# EAGLE design Open Ephys Isolater (EAGLE 7.3.0)
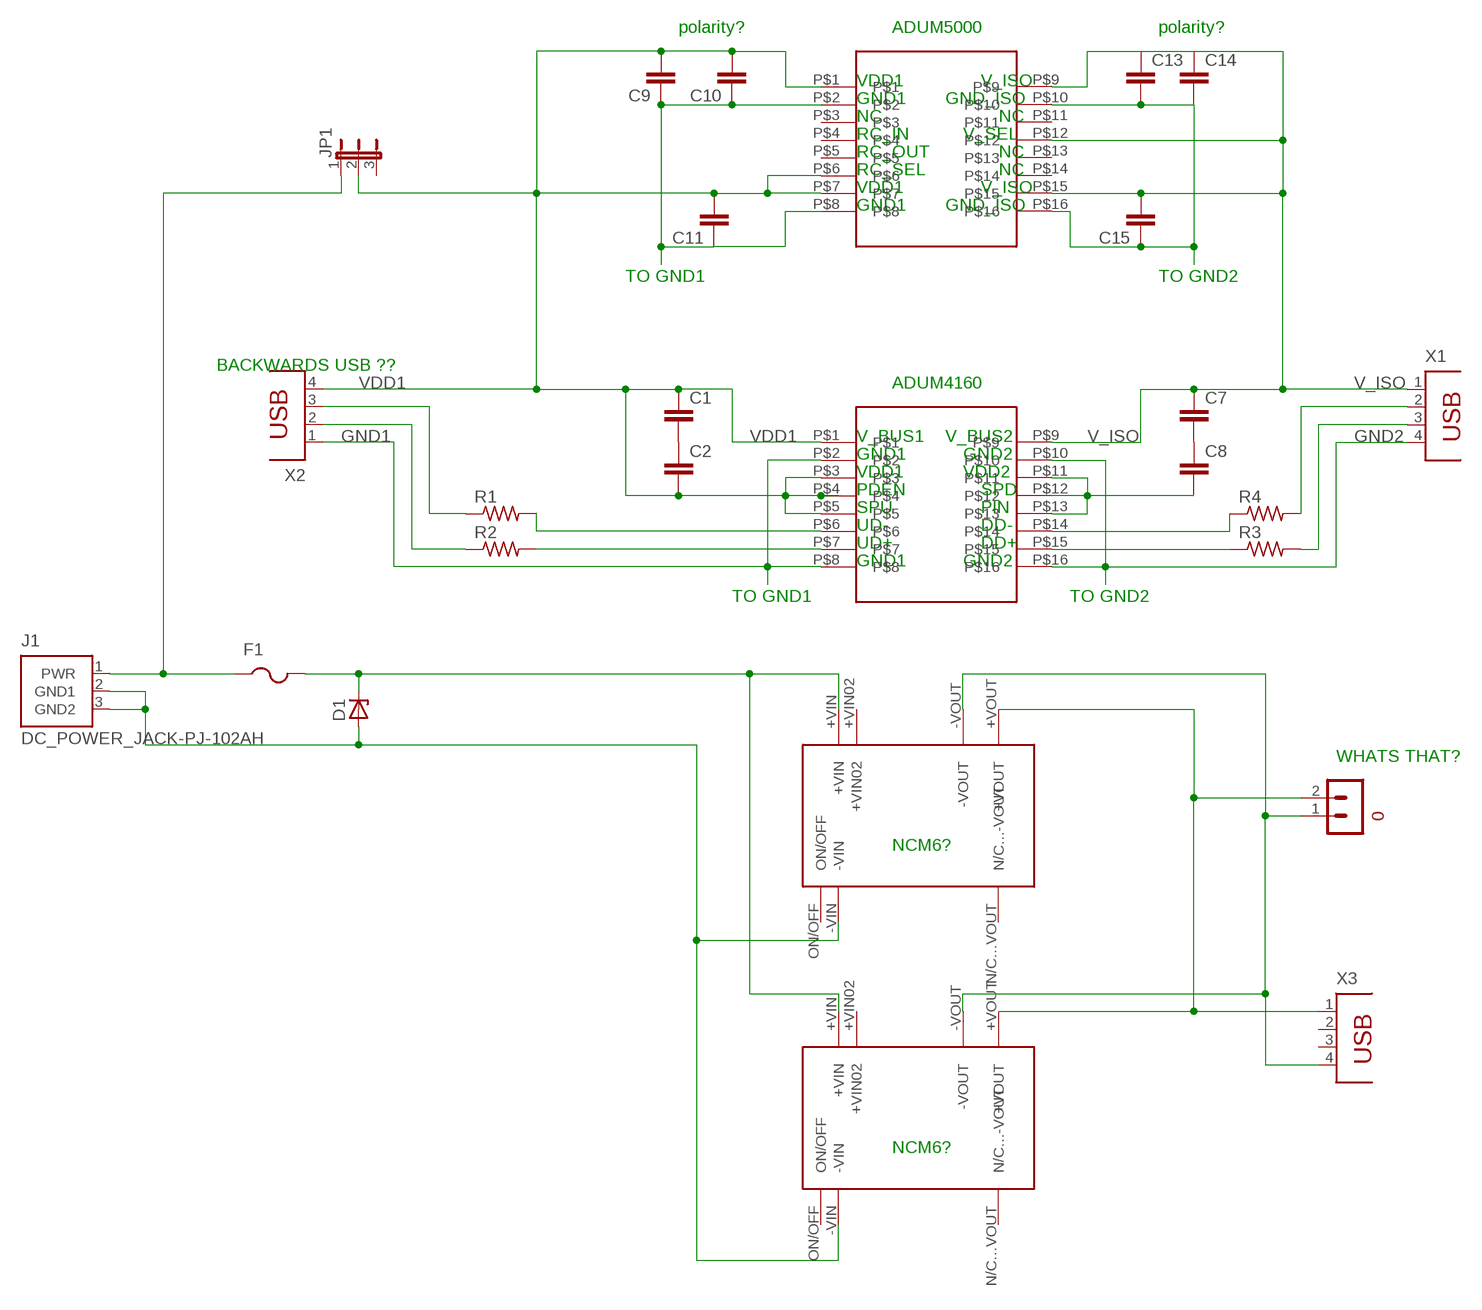
[diagram p0: schematic, sheet 1]

## Parts
C1  C_0201  [0201]
C2  C_0201  [0201]
C7  C_0201  [0201]
C8  C_0201  [0201]
C9  C_0201  [0201]
C10  C_0201  [0201]
C11  C_0201  [0201]
C13  C_0201  [0201]
C14  C_0201  [0201]
C15  C_0201  [0201]
D1  ZENER-DIODESMB  [SMB]
F1  PTCFUSE-1206  [R1206]
J1  DC_POWER_JACK-PJ-102AH  [PJ-102AH]
JP1  JP2E  [JP2]
R1  R-US_R2512  [R2512]
R2  R-US_R2512  [R2512]
R3  R-US_R2512  [R2512]
R4  R-US_R2512  [R2512]
S1  TERMINAL_BLOCK_2-3.5MM-5V  [TERMINAL_BLOCK_3.5MM_2_5V]
U$1  ADUM4160  [ADUM4160]
U$2  ADUM4160  [ADUM4160]
U$3  NCM6S0505EC  [NCM6S0505EC]
U$4  NCM6S0505EC  [NCM6S0505EC]
X1  PN87520  [PN87520]
X2  PN61729  [PN61729]
X3  PN87520  [PN87520]

## Nets
GND1: C9.1 C10.1 C11.1 D1.A J1.2(GND1) J1.3(GND2) U$1.P$2 U$1.P$8 U$2.P$2 U$2.P$8 U$3.-VIN U$4.-VIN X2.1
GND2: C13.2 C14.2 C15.1 S1.1 U$1.P$10 U$1.P$16 U$2.P$10 U$2.P$16 U$3.-VOUT U$4.-VOUT X1.4 X3.4
N$1: R1.1 X2.3
N$5: R1.2 U$2.P$6
N$6: R2.2 U$2.P$7
N$7: F1.1 J1.1(PWR) JP1.1
N$8: C7.2 C8.1
N$9: R2.1 X2.2
N$10: C8.2 U$2.P$11 U$2.P$12 U$2.P$13
N$11: C1.2 C2.1
N$12: S1.2 U$3.+VOUT U$4.+VOUT X3.1
N$13: R4.1 U$2.P$14
N$14: R3.1 U$2.P$15
N$21: R3.2 X1.3
N$22: R4.2 X1.2
N$25: D1.C F1.2 U$3.+VIN U$4.+VIN
V_ISO: C7.1 C13.1 C14.1 C15.2 U$1.P$9 U$1.P$12 U$1.P$15 U$2.P$9 X1.1
VDD1: C1.1 C2.2 C9.2 C10.2 C11.2 JP1.2 U$1.P$1 U$1.P$6 U$1.P$7 U$2.P$1 U$2.P$3 U$2.P$4 U$2.P$5 X2.4
Unconnected: JP1.3 U$1.P$3 U$1.P$4 U$1.P$5 U$1.P$11 U$1.P$13 U$1.P$14 U$3.+VIN02 U$3.N/C...VOUT(N/C...-VOUT) U$3.ON/OFF U$4.+VIN02 U$4.N/C...VOUT(N/C...-VOUT) U$4.ON/OFF X3.2 X3.3

## Notes on the sheet
- polarity? | ADUM5000 | polarity?
- VDD1 | V_ISO
- GND1 | GND_ISO
- NC | NC
- RC_IN | V_SEL
- RC_OUT | NC
- RC_SEL | NC
- VDD1 | V_ISO
- GND1 | GND_ISO
- TO GND1 | TO GND2
- BACKWARDS USB ??
- ADUM4160
- V_BUS1 | V_BUS2
- GND1 | GND2
- VDD1 | VDD2
- PDEN | SPD
- SPU | PIN
- UD- | DD-
- UD+ | DD+
- GND1 | GND2
- TO GND1 | TO GND2
- WHATS THAT?
- NCM6?
- NCM6?

## Library data of the parts
C1 C2 C7-C11 C13-C15 = RHD2000_eval_board:C: Capacitor
D1 = diode:ZENER-DIODE: Z-Diode
F1 = adafruit:PTCFUSE: PTC fuses, resettable thermistors
J1 = RHD2000_eval_board:DC_POWER_JACK: DC Power Jack
JP1 = jumper:JP2E: JUMPER
R1-R4 = adafruit:R-US_: RESISTOR, American symbol
S1 = RHD2000_eval_board:TERMINAL_BLOCK_2: 2-point terminal block
U$1 U$2 = Analog Devices Isolators:ADUM4160
U$3 U$4 = Murata DC:DC converter:NCM6S0505EC
X1 X3 = con-berg:PN87520: BERG USB connector; OC_FARNELL: unknown; OC_NEWARK: unknown
X2 = con-berg:PN61729: BERG USB connector; OC_FARNELL: unknown; OC_NEWARK: unknown

## Board
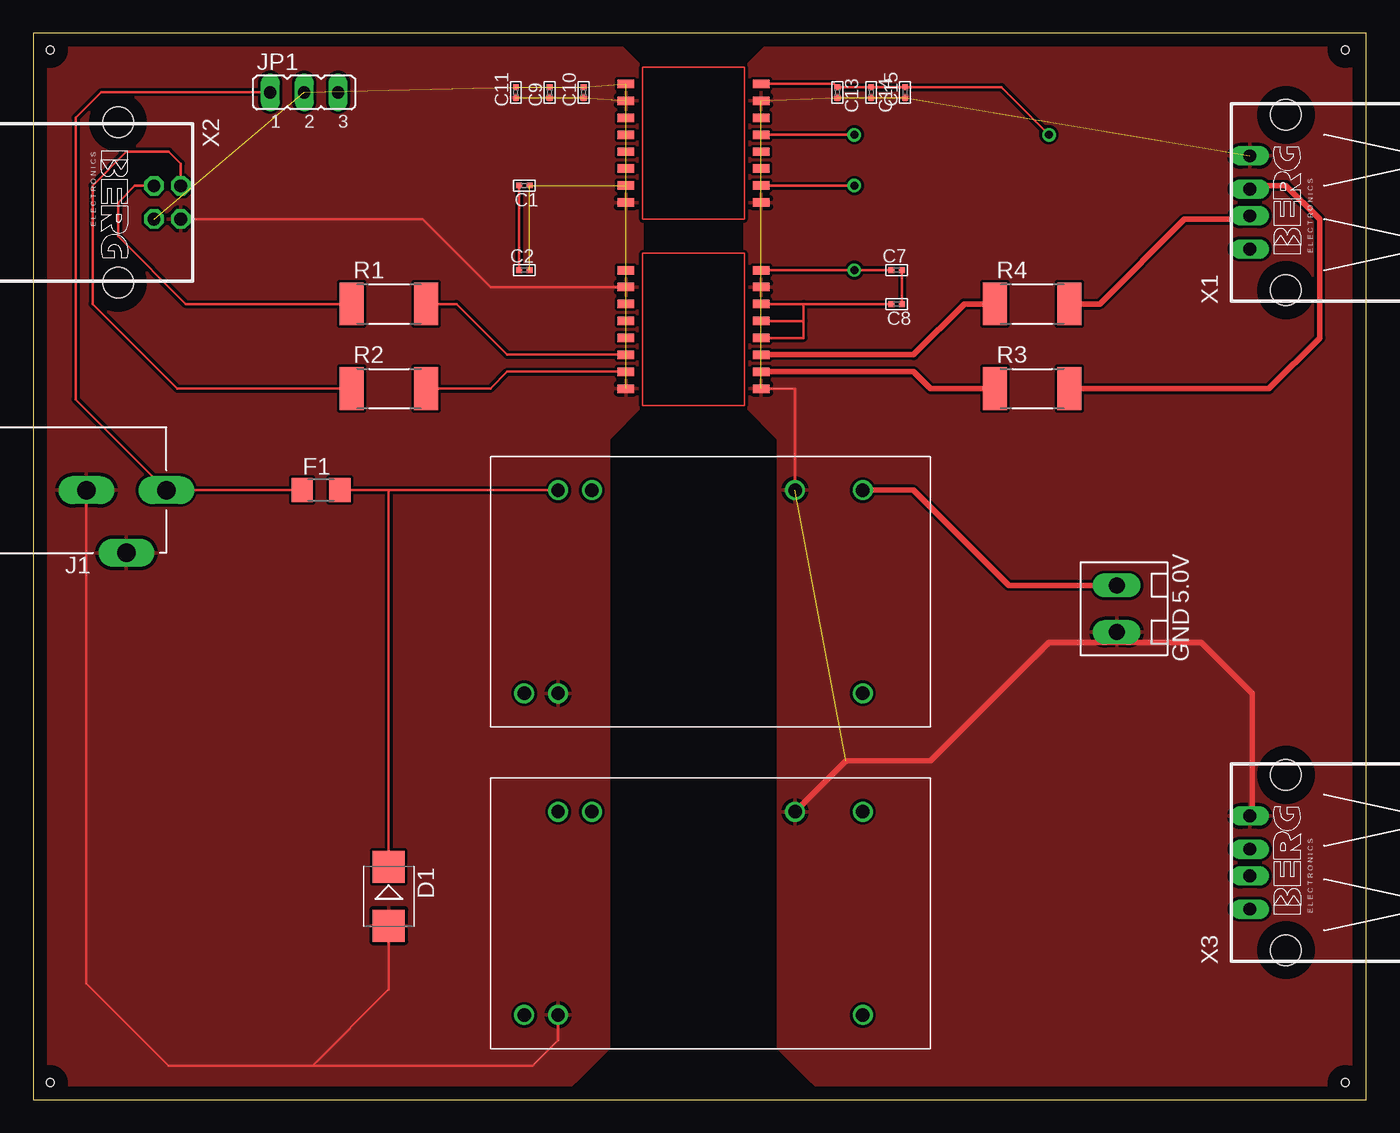
[diagram p1: board, top side]
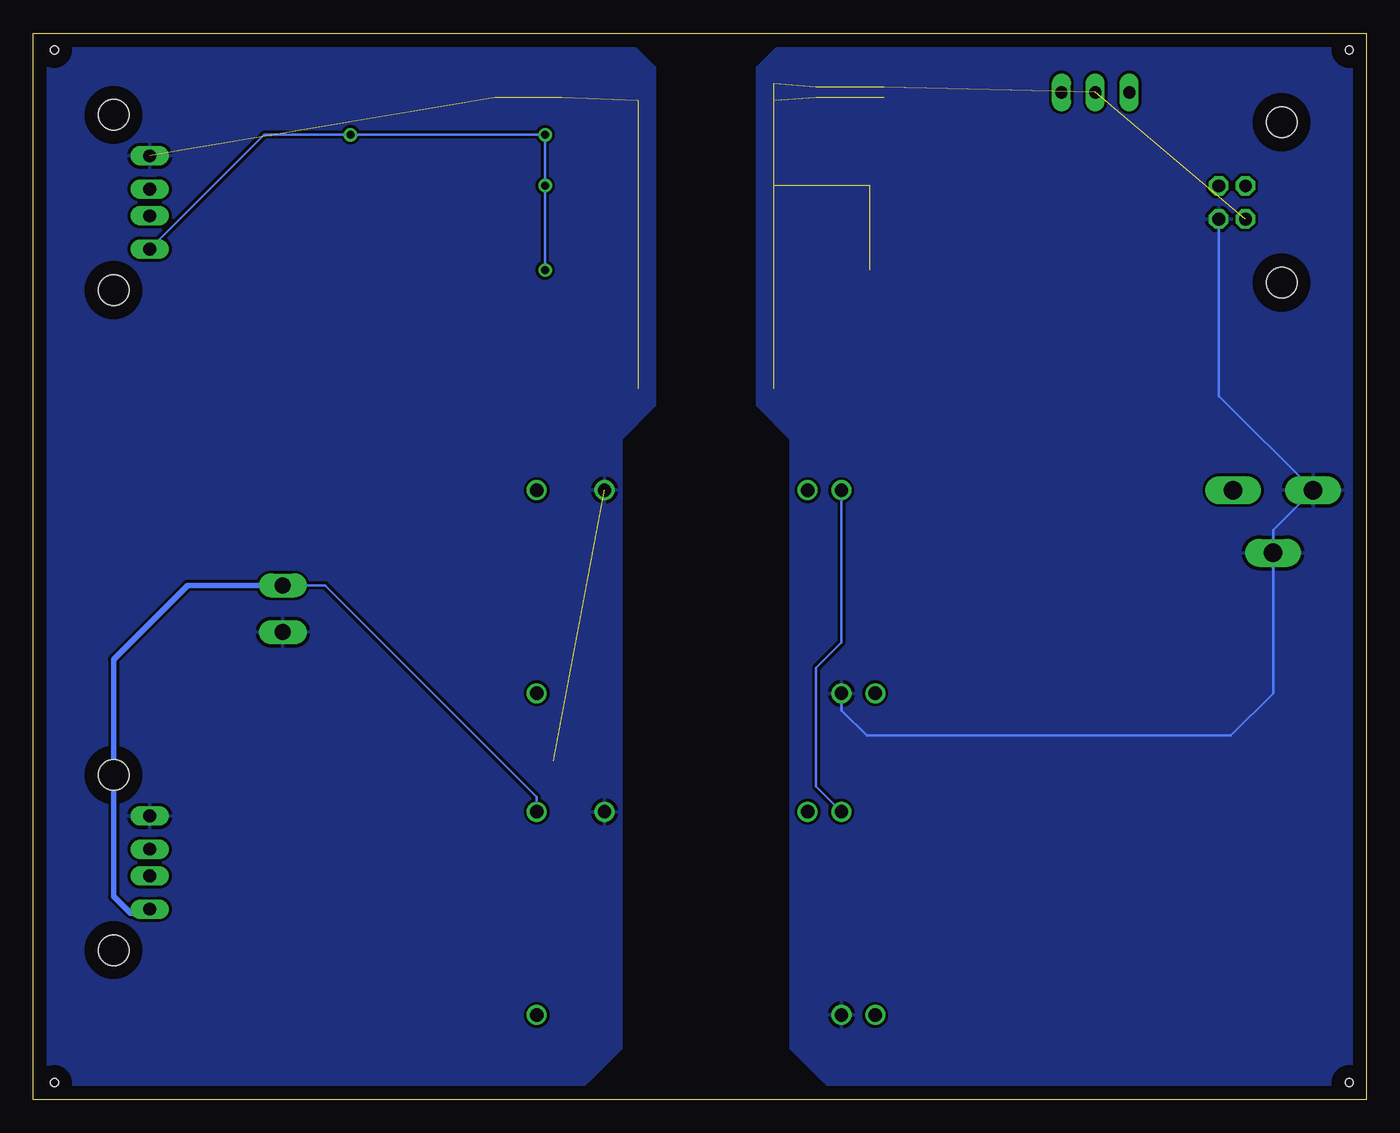
[diagram p2: board, bottom side, seen from below]

Size 100 x 80 mm. Coordinates in mm from the lower left corner, seen from the top.
Outline: 0,0 100,0 100,80 0,80 0,0
Copper layers (1*16): Top 0.035mm / dielectric 1.5mm / Bottom 0.035mm
Design rules "default": minimum track width 10mil, minimum drill 24mil, track to track 8mil, track to pad 8mil, pad to pad 8mil, via to via 8mil, smd to smd 8mil, copper to edge 40mil, drill to drill 8mil, minimum pad ring 10mil, minimum via ring 8mil, stop-mask expansion 4mil, vias tented up to drill 0mil, thermal gap 10mil
Holes 0.6 mm at 1.27,78.74 1.27,1.27 98.42,78.74 98.42,1.27

### Footprints (pad centres in the part's own frame; a part is rotated, then mirrored left to right if it is on the bottom)
0201 = smd 0.432 x 0.432: 1 -0.394,0; 2 0.394,0
SMB = smd 2.4 x 2.4: A 2.2,0; C -2.2,0
R1206 = smd 1.6 x 1.803: 1 -1.422,0; 2 1.422,0
PJ-102AH = drill 1.4 long: 1 0,-3; 2 0,3; 3 -4.7,0
JP2 = drill 0.914 long: 1 -2.54,0; 2 0,0; 3 2.54,0
R2512 = smd 1.8 x 3.2: 1 -2.8,0; 2 2.8,0
TERMINAL_BLOCK_3.5MM_2_5V = drill 1.2 long: 1 -1.75,0; 2 1.75,0
ADUM4160 = smd 1.27 x 0.635: P$1 -5.08,8.89; P$2 -5.08,7.62; P$3 -5.08,6.35; P$4 -5.08,5.08; P$5 -5.08,3.81; P$6 -5.08,2.54; P$7 -5.08,1.27; P$8 -5.08,0; P$9 5.08,8.89; P$10 5.08,7.62; P$11 5.08,6.35; P$12 5.08,5.08; P$13 5.08,3.81; P$14 5.08,2.54; P$15 5.08,1.27; P$16 5.08,0
NCM6S0505EC = drill 1: +VIN 5.08,20.32; +VIN02 7.62,20.32; +VOUT 27.94,20.32; -VIN 5.08,5.08; -VOUT 22.86,20.32; N/C...VOUT 27.94,5.08; ON/OFF 2.54,5.08
PN87520 = drill 0.95 long: 1 -3.5,2.71; 2 -1,2.71; 3 1,2.71; 4 3.5,2.71 | hole 2.3: -6.57,0; 6.57,0
PN61729 = drill 0.95 octagon: 1 1.25,4.71; 2 -1.25,4.71; 3 -1.25,2.71; 4 1.25,2.71 | hole 2.3: -6.02,0; 6.02,0

### Placement (x,y rotation side)
C1  36.83,68.58 180 top
C2  36.83,62.23 0 top
C7  64.77,62.23 0 top
C8  64.77,59.69 180 top
C9  38.73,75.56 90 top
C10  41.27,75.56 90 top
C11  36.2,75.56 90 top
C13  60.33,75.56 270 top
C14  62.87,75.56 270 top
C15  65.41,75.56 90 top
D1  26.67,15.24 270 top
F1  21.59,45.72 0 top
J1  6.99,45.72 90 top
JP1  20.32,75.56 0 top
R1  26.67,59.69 0 top
R2  26.67,53.34 0 top
R3  74.93,53.34 0 top
R4  74.93,59.69 0 top
S1  81.28,36.83 90 top
U$1  49.53,67.31 0 top
U$2  49.53,53.34 0 top
U$3  34.29,1.27 0 top
U$4  34.29,25.4 0 top
X1  93.98,67.31 90 top
X2  6.35,67.31 270 top
X3  93.98,17.78 90 top

### Tracks (layer width: path | path; a pad name or v marks a point on that pad's centre or on a via)
GND1  (6 unrouted)
  Top 0.2: U$3.-VIN 39.37,4.45 37.47,2.54 20.95,2.54 | 20.95,2.54 10.16,2.54 3.98,8.71 J1.2 | D1.A 26.67,8.26 20.95,2.54 | X2.1 29.19,66.06 34.29,60.96 U$2.P$2
  Bottom 0.2: U$4.-VIN 39.37,29.21 37.47,27.3 10.16,27.3 6.99,30.48 J1.3 6.99,42.72 J1.2 11.06,52.8 X2.1
  pour Bottom: 43.18,12.06 43.18,49.53 45.72,52.07 45.72,77.47 42.55,80.64 -0.64,80.64 -0.64,-1.27 38.1,-1.27 43.18,3.81
  pour Top: 43.18,20.95 43.18,49.53 45.72,52.07 45.72,77.47 42.55,80.64 -0.64,80.64 -0.64,-1.27 38.1,-1.27 43.18,3.81
GND2  (8 unrouted)
  Top 0.2: U$2.P$16 57.15,53.34 U$4.-VOUT
  Top 0.406: U$3.-VOUT 60.96,25.4 67.31,25.4 76.2,34.29 80.49,34.29 | 80.49,34.29 S1.1 | 80.49,34.29 87.63,34.29 91.44,30.48 91.44,21.45 X3.4
  pour Top: 55.88,15.24 55.88,49.53 53.34,52.07 53.34,77.47 56.52,80.64 100.97,80.64 100.97,-1.27 60.96,-1.27 55.88,3.81
  pour Bottom: 55.88,49.53 53.34,52.07 53.34,77.47 56.52,80.64 100.97,80.64 100.97,-1.27 60.96,-1.27 55.88,3.81
N$1
  Top 0.2: X2.3 7.6,68.56 6.35,67.31 6.35,64.77 11.43,59.69 R1.1
N$5
  Top 0.2: R1.2 31.75,59.69 35.56,55.88 U$2.P$6
N$6
  Top 0.2: R2.2 34.29,53.34 35.56,54.61 U$2.P$7
N$7
  Top 0.2: F1.1 J1.1 3.17,52.53 3.17,73.66 5.08,75.56 JP1.1
N$8
  Top 0.2: C7.2 C8.1
N$9
  Top 0.2: X2.2 11.06,70.22 10.16,71.12 6.99,71.12 4.45,68.58 4.45,59.69 10.79,53.34 R2.1
N$10
  Top 0.2: U$2.P$11 57.78,59.69 | 57.78,59.69 C8.2 | U$2.P$12 57.78,58.42 | 57.78,58.42 57.78,59.69 | U$2.P$13 57.78,57.15 57.78,58.42
N$11
  Top 0.2: C1.2 C2.1
N$12
  Top 0.406: S1.2 73.18,38.58 66.04,45.72 U$4.+VOUT
  Bottom 0.2: U$3.+VOUT 62.23,22.7 78.11,38.58 S1.2
  Bottom 0.406: S1.2 88.42,38.58 93.98,33.02 93.98,15.24 92.71,13.97 91.58,13.97 X3.1
N$13
  Top 0.406: R4.1 69.85,59.69 66.04,55.88 U$2.P$14
N$14
  Top 0.406: U$2.P$15 66.04,54.61 67.31,53.34 R3.1
N$21
  Top 0.406: R3.2 92.71,53.34 96.52,57.15 96.52,66.04 93.98,68.58 91.54,68.58 X1.3
N$22
  Top 0.406: R4.2 80.01,59.69 86.36,66.04 91,66.04 X1.2
N$25
  Top 0.2: F1.2 26.67,45.72 | 26.67,45.72 D1.C | 26.67,45.72 U$4.+VIN
  Bottom 0.2: U$4.+VIN 39.37,34.29 41.27,32.38 41.27,23.5 U$3.+VIN
V_ISO  (via drill 0.6)
  Top 0.2: U$1.P$9 60.08,76.2 C13.1 C14.1 C15.2 72.63,75.96 v76.2,72.39 | C7.1 v61.59,62.23 U$2.P$9 | U$1.P$15 v61.59,68.58 | U$1.P$12 v61.59,72.39
  Bottom 0.2: v61.59,62.23 v61.59,68.58 v61.59,72.39 v76.2,72.39 82.69,72.39 X1.1
VDD1  (13 unrouted)